# EAGLE design rf (EAGLE 9.1.3)
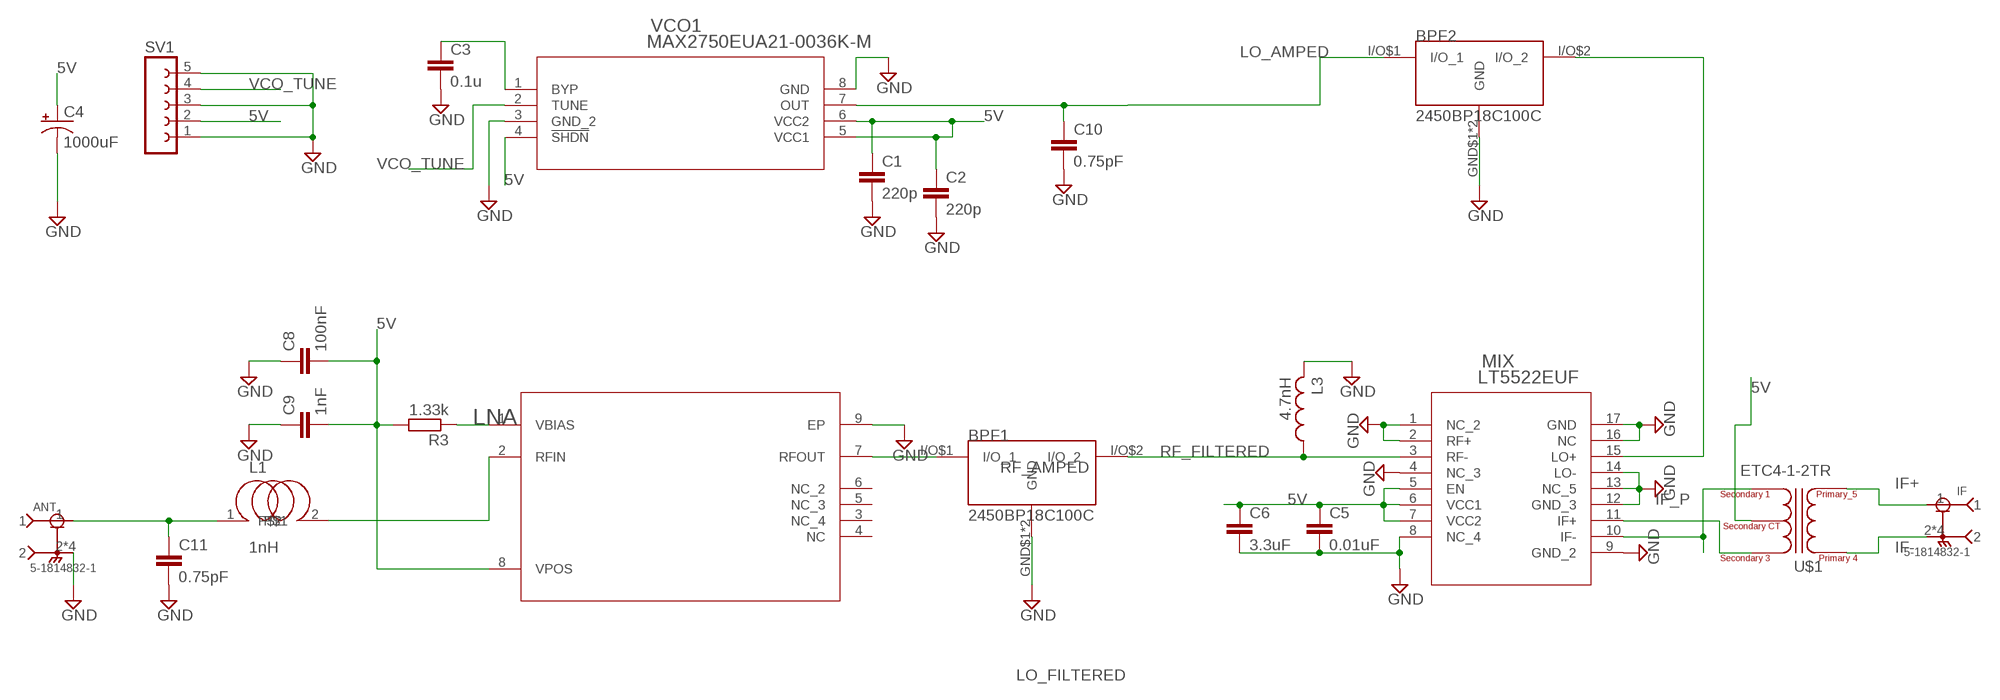
[diagram p0: schematic, sheet 1]

## Parts
ANT  5-1814832-1  [TE_5-1814832-1]
BPF1  2450BP18C100C  [SMD]
BPF2  2450BP18C100C  [SMD]
C1  220p  C-EUC0805K  [C0805K]
C2  220p  C-EUC0805K  [C0805K]
C3  0.1u  C-EUC0805  [C0805]
C4  1000uF  CPOL-US153CLV-1010  [153CLV-1010]
C5  0.01uF  C-EUC0805  [C0805]
C6  3.3uF  C-EUC0805  [C0805]
C8  100nF  C-EUC0805  [C0805]
C9  1nF  C-EUC0805  [C0805]
C10  0.75pF  C-EUC0805  [C0805]
C11  0.75pF  C-EUC0805  [C0805]
IF  5-1814832-1  [TE_5-1814832-1]
L1  1nH  COILCRAFT_INDUCTOR0603/1608M  [INDC1607X61]
L3  4.7nH  L2012M  [INDC2518X180]
LNA  ADL5523ACPZ-R7CP_8_2-M  [CP_8_2-M]
MIX  LT5522EUF  [QFN-16_UF]
R3  1.33k  R-EU_R0805  [R0805]
SV1  FE05-1  [FE05-1]
U$1  ETC4-1-2TR  [SM-22]
VCO1  MAX2750EUA21-0036K-M  [21-0036K-M]

## Nets
5V: C1.1 C2.1 C4.+ C5.1 C6.1 C8.2 C9.2 LNA.8(VPOS) MIX.5(EN) MIX.6(VCC1) MIX.7(VCC2) R3.2 SV1.2 U$1.2(SECONDARY_CT) VCO1.4(!SHDN) VCO1.5(VCC1) VCO1.6(VCC2)
ANTENNA_IN [RF_2G4]: ANT.1 C11.1 L1.1
GND: ANT.2 ANT.3 ANT.4 ANT.5 BPF1.GND$1(GND) BPF1.GND$2(GND) BPF2.GND$1(GND) BPF2.GND$2(GND) C1.2 C2.2 C3.2 C4.- C5.2 C6.2 C8.1 C9.1 C10.2 C11.2 L3.2 LNA.9(EP) MIX.1(NC_2) MIX.2(RF+) MIX.4(NC_3) MIX.8(NC_4) MIX.9(GND_2) MIX.12(GND_3) MIX.13(NC_5) MIX.14(LO-) MIX.16(NC) MIX.17(GND) SV1.1 SV1.3 SV1.5 VCO1.3(GND_2) VCO1.8(GND)
IF+: IF.1 U$1.5(PRIMARY_5)
IF-: IF.2 IF.3 IF.4 IF.5 U$1.4(PRIMARY_4)
IF_P: MIX.11(IF+) U$1.3(SECONDARY_3)
LO_AMPED [RF_2G4]: BPF2.I/O$1(I/O_1) C10.1 VCO1.7(OUT)
LO_FILTERED [RF_2G4]: BPF2.I/O$2(I/O_2) MIX.15(LO+)
N$1: LNA.1(VBIAS) R3.1
N$2: C3.1 VCO1.1(BYP)
N$4: MIX.10(IF-) U$1.1(SECONDARY_1)
N$5 [RF_2G4]: L1.2 LNA.2(RFIN)
RF_AMPED [RF_2G4]: BPF1.I/O$1(I/O_1) LNA.7(RFOUT)
RF_FILTERED [RF_2G4]: BPF1.I/O$2(I/O_2) L3.1 MIX.3(RF-)
VCO_TUNE: SV1.4 VCO1.2(TUNE)
Unconnected: LNA.3(NC_4) LNA.4(NC) LNA.5(NC_3) LNA.6(NC_2)

## Library data of the parts
ANT IF = 5-1814832-1:5-1814832-1: SMA Str PCB Skt GZD; MANUFACTURER: TE Connectivity; PARTREV: B1; STANDARD: Manufacturer recommendations
BPF1 BPF2 = Johanson BPF 2450BP18C100C:2450BP18C100C
C1-C3 C5 C6 C8-C11 = rcl:C-EU: CAPACITOR, European symbol; SPICEPREFIX: C
C4 = rcl:CPOL-US: POLARIZED CAPACITOR, American symbol; SPICEPREFIX: C
L1 = Passives:COILCRAFT_INDUCTOR
L3 = Passives:L2012M
LNA = ADL5523ACPZ-R7:ADL5523ACPZ-R7: LNA for 2.4GHz
MIX = LT5522:LT5522EUF; MANUFACTURER_PART_NUMBER: LT5522EUF; VENDOR: Linear Technology
R3 = rcl:R-EU_: RESISTOR, European symbol; SPICEPREFIX: R
SV1 = con-lsta:FE05-1: FEMALE HEADER; OC_FARNELL: unknown; OC_NEWARK: unknown
U$1 = ETC4-1-2TR:ETC4-1-2TR
VCO1 = MAX2750EUA+:MAX2750EUA; MANUFACTURER_PART_NUMBER: MAX2750EUA+; VENDOR: Maxim

## Net classes
1 RF_2G4: width 0.419 mm, clearance 2 mm

## Board
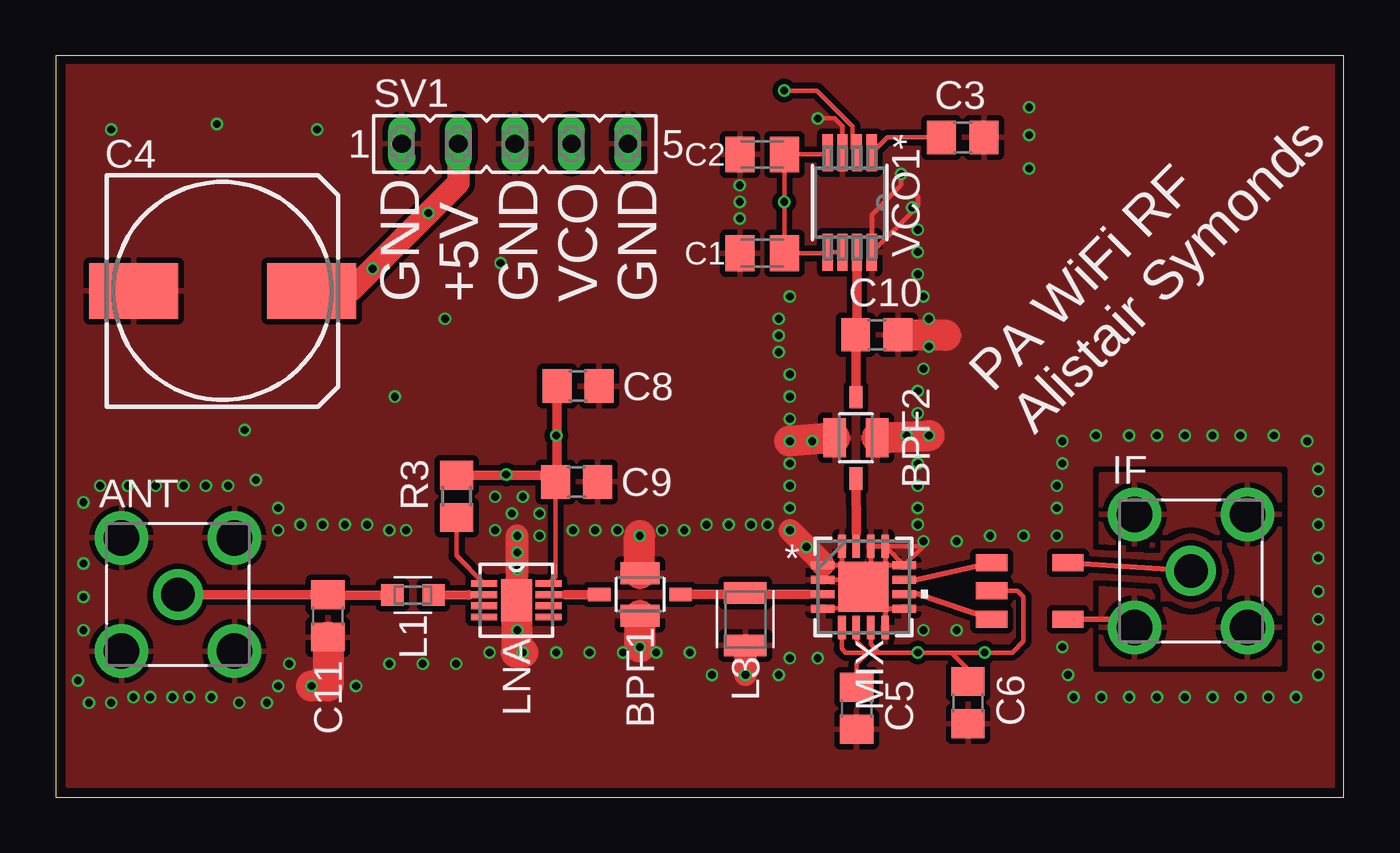
[diagram p1: board, top side]
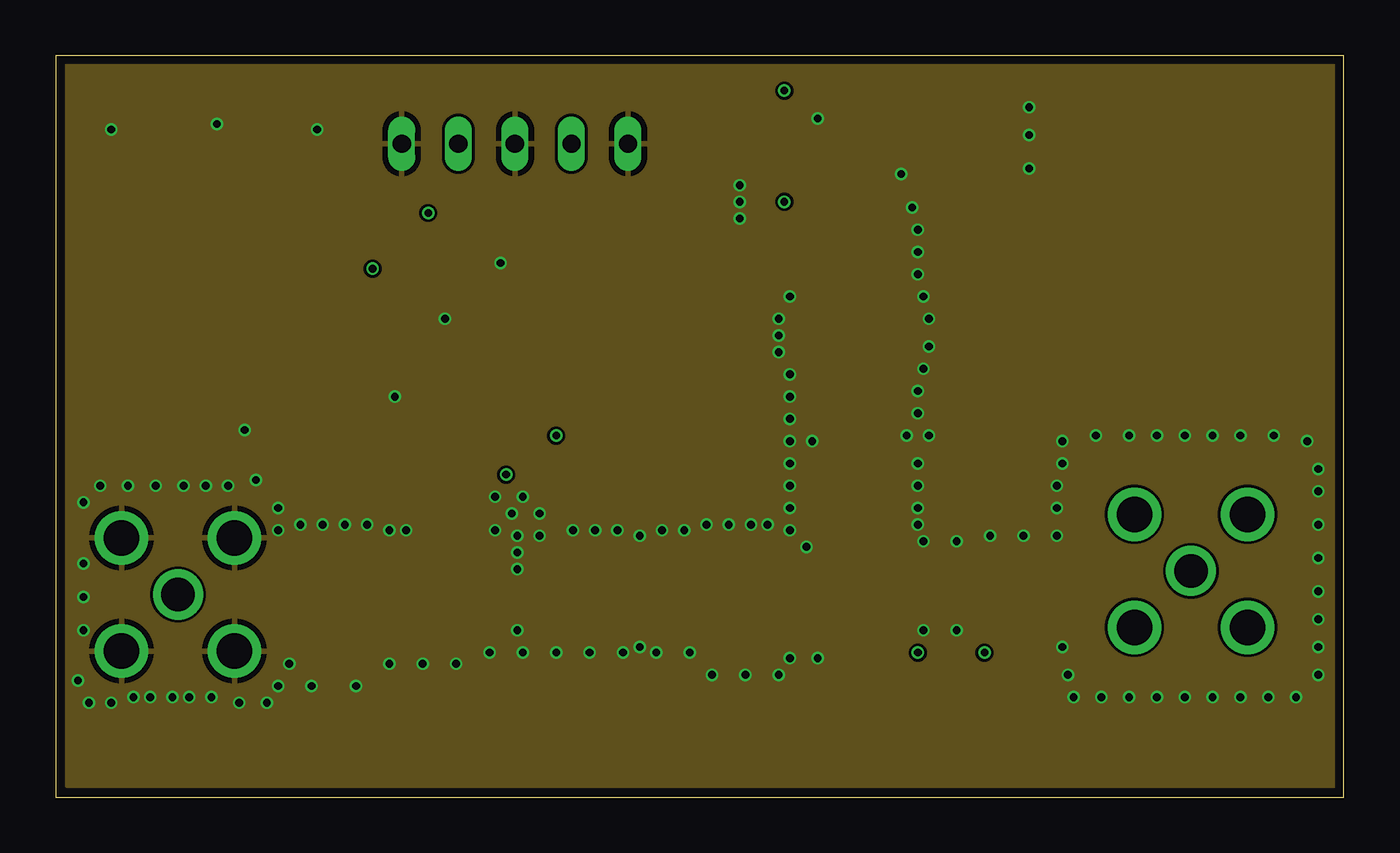
[diagram p2: board, inner layer Route2]
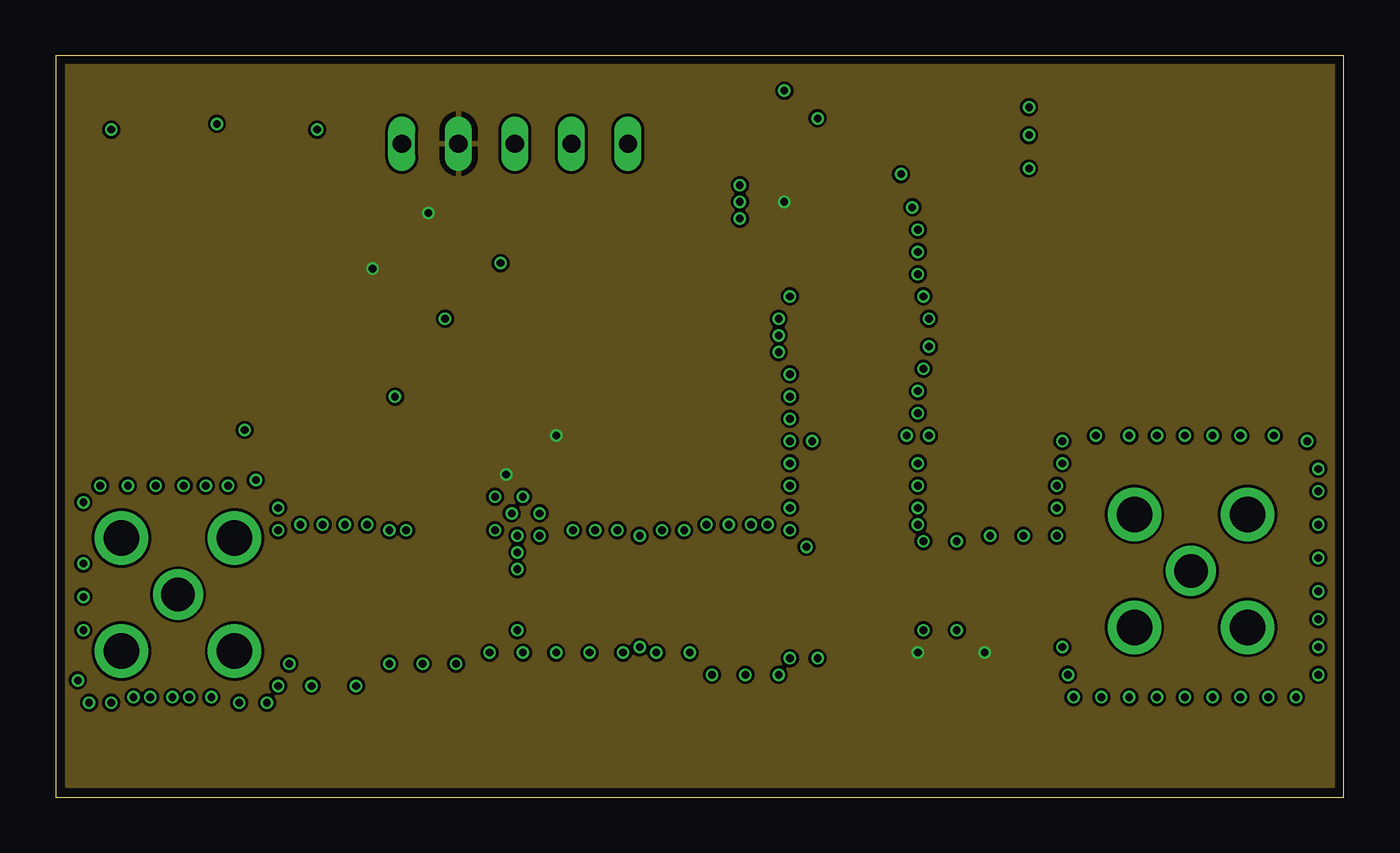
[diagram p3: board, inner layer Route15]
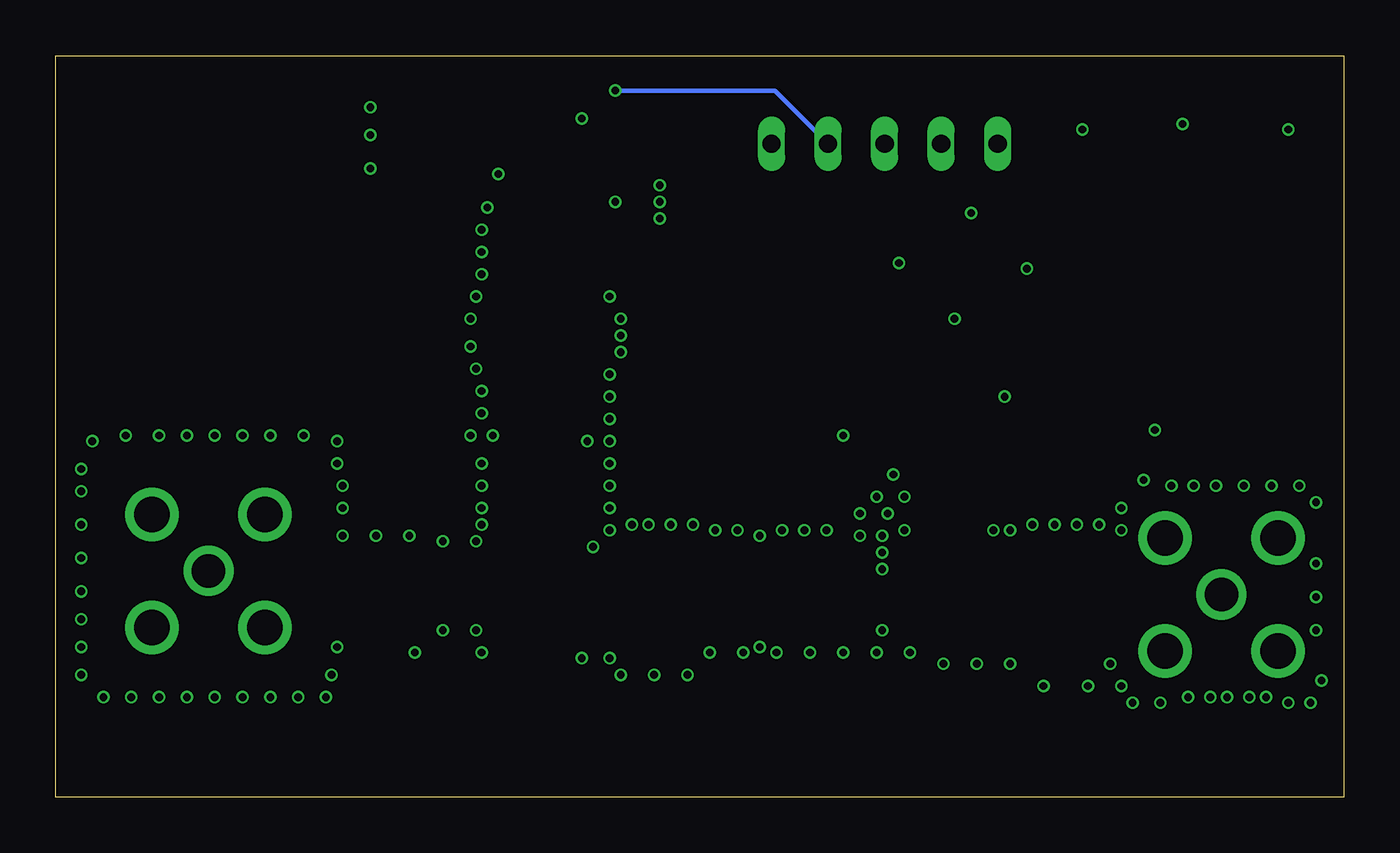
[diagram p4: board, bottom side, seen from below]

Size 57.9 x 33.32 mm. Coordinates in mm from the lower left corner, seen from the top.
Outline: 0,0 57.9,0 57.9,33.32 0,33.32 0,0
Copper layers (1*2*15*16): Top 0.035559375mm / dielectric 0.17018125mm / Route2 0.01778125mm / dielectric 47mil / Route15 0.01778125mm / dielectric 0.17018125mm / Bottom 0.035559375mm
Design rules "oshpark_4layer": minimum track width 5mil, minimum drill 10mil, track to track 5mil, track to pad 5mil, pad to pad 5mil, via to via 5mil, smd to smd 5mil, copper to edge 15mil, drill to drill 6mil, minimum pad ring 4mil, minimum via ring 4mil, stop-mask expansion 2.5mil, vias tented up to drill 0mil, thermal gap 10mil

### Footprints (pad centres in the part's own frame; a part is rotated, then mirrored left to right if it is on the bottom)
TE_5-1814832-1 = drill 1.5: 1 0,0 | drill 1.6: 2 -2.54,2.54; 3 2.54,2.54; 4 -2.54,-2.54; 5 2.54,-2.54
SMD = smd 1.75 x 1: GND$1 1.825,0.95; GND$2 1.825,-0.95 | smd 1 x 0.6: I/O$1 0,0; I/O$2 3.65,0
C0805K = smd 1.3 x 1.6: 1 -1,0; 2 1,0
C0805 = smd 1.3 x 1.5: 1 -0.95,0; 2 0.95,0
153CLV-1010 = smd 4 x 2.5: + 4,0; - -4,0
INDC1607X61 = smd 0.992 x 0.972: 1 -0.925,0; 2 0.925,0
INDC2518X180 = smd 0.962 x 1.912: 1 -1.175,0; 2 1.175,0
CP_8_2-M = smd 1.168 x 0.305: 1 -1.448,0.75; 2 -1.448,0.25; 3 -1.448,-0.25; 4 -1.448,-0.75; 5 1.448,-0.75; 6 1.448,-0.25; 7 1.448,0.25; 8 1.448,0.75 | smd 1.397 x 1.88: 9 0,0
QFN-16_UF = smd 1.055 x 0.35: 1 -1.827,0.975; 2 -1.827,0.325; 3 -1.827,-0.325; 4 -1.827,-0.975; 9 1.827,-0.975; 10 1.827,-0.325; 11 1.827,0.325; 12 1.827,0.975 | smd 0.35 x 1.055: 5 -0.975,-1.827; 6 -0.325,-1.827; 7 0.325,-1.827; 8 0.975,-1.827; 13 0.975,1.827; 14 0.325,1.827; 15 -0.325,1.827; 16 -0.975,1.827 | smd 2.25 x 2.25: 17 0,0
R0805 = smd 1.3 x 1.5: 1 -0.95,0; 2 0.95,0
FE05-1 = drill 0.813 long: 1 -5.08,0; 2 -2.54,0; 3 0,0; 4 2.54,0; 5 5.08,0
SM-22 = smd 0.76 x 1.4: 1 0,3.43; 2 1.27,3.43; 3 2.54,3.43; 4 0,0; 5 2.54,0
21-0036K-M = smd 1.676 x 0.457: 1 -2.235,0.991; 2 -2.235,0.33; 3 -2.235,-0.33; 4 -2.235,-0.991; 5 2.235,-0.991; 6 2.235,-0.33; 7 2.235,0.33; 8 2.235,0.991

### Placement (x,y rotation side)
ANT  5.5,9.11 0 top
BPF1  24.44,9.11 0 top
BPF2  35.97,17.97 270 top
C1  31.76,24.44 180 top
C2  31.76,28.88 180 top
C3  40.77,29.65 0 top
C4  7.5,22.75 0 top
C5  36,4 270 top
C6  41,4.25 270 top
C8  23.48,18.47 180 top
C9  23.41,14.17 180 top
C10  36.91,20.78 0 top
C11  12.24,8.15 270 top
IF  51.03,10.17 0 top
L1  16.06,9.08 0 top
L3  31,8 270 top
LNA  20.71,8.85 0 top
MIX  36.31,9.45 0 top
R3  18.02,13.52 90 top
SV1  20.64,29.36 0 top
U$1  45.5,8 90 top
VCO1  35.69,26.72 270 top

### Tracks (layer width: path | path; a pad name or v marks a point on that pad's centre or on a via)
5V  (via drill 0.35)
  Top 0.2: LNA.8 22.46,9.9 C9.2 22.5,14.21 v22.5,16.25 | U$1.2 43.23,9.27 43.5,9 43.5,7 43,6.5 v41.75,6.5 40.25,6.5 | 36.5,6.5 36.02,6.98 36.02,7.59 MIX.6 | 40.25,6.5 v38.75,6.5 37,6.5 | 37,6.5 36.5,6.5 | MIX.5 35.34,6.66 35.5,6.5 36.5,6.5 | MIX.7 36.63,6.87 37,6.5 | VCO1.4 34.62,28.88 C2.1 v32.76,26.76 v32.75,26.75 v32.76,26.74 C1.1 34.66,24.44 VCO1.5 VCO1.6 | C5.1 36,6 36.5,6.5 | C6.1 41,5.75 40.25,6.5
  Top 0.419: R3.2 22.16,14.47 C9.2 22.53,14.24 C8.2
  Top 1: C4.+ 13.25,22.75 v14.25,23.75 v16.75,26.25 18.1,27.6 SV1.2
  other vias: 20.25,14.5
  pour Route15 (rank 6): 0.5,33 0.5,0.5 57.5,0.5 57.5,33
ANTENNA_IN
  Top 0.419: L1.1 12.26,9.08 C11.1 ANT.1
GND  (via drill 0.35)
  Top 0.2: VCO1.3 35.36,30.14 35,30.5 v34.25,30.5 | 38,27.75 38,27.5 36.68,26.18 VCO1.8 38.75,26.55 38.75,27 | MIX.13 MIX.12 | MIX.13 MIX.14 36.63,9.77 MIX.17 | MIX.4 34.51,8.5 35.5,8.5 36.31,9.31 | 36.31,9.31 MIX.17 | 35.34,10.43 MIX.1 MIX.2 35.98,9.77 MIX.17 | 35.34,10.43 MIX.17 | MIX.12 37.42,10.43 36.38,9.38 | 36.38,9.38 36.31,9.31 | MIX.8 37.28,8.46 36.5,9.25 | 36.5,9.25 36.38,9.38 | MIX.9 37.27,8.47 36.5,9.25 | MIX.16 35.34,10.43 | 35.34,10.43 MIX.17 | MIX.13 38.78,11.28 v39,11.5 39,11.29 MIX.12 | MIX.13 37.28,10.43 MIX.17 | 15.56,29.11 SV1.1
  Top 1: LNA.9 20.73,10.84 v20.75,11.75 | MIX.1 34.48,10.52 v33.75,11.25 v33,12 | L3.2 v31,5.5
  Top 1.4: C10.2 39.97,20.78 40,20.75 | v39.25,16.25 36.93,16.16 BPF2.GND$1 | BPF2.GND$2 v33,16 | LNA.9 20.71,6.5 v21,6.5 | BPF1.GND$1 26.25,10.06 v26.25,11.75 | BPF1.GND$2 26.25,8.16 v26.25,6.75 | C11.2 12.24,5 v11.5,5
  other vias: 10.5,6 13.5,5 15,6 16.5,6 18,6 19.5,6.5 22.5,6.5 24,6.5 25.5,6.5 27,6.5 28.5,6.5 29.5,5.5 32.5,5.5 39,7.5 40.5,7.5 40.5,11.5 31.25,12.25 32,12.25 33,13 33,14 33,15 33,17 33,18 33,19 32.5,20 32.5,21.5 33,22.5 30.75,27.5 30.75,26.75 30.75,26 34,16 38.25,16.25 38,28 38.5,26.5 38.75,25.5 38.75,24.5 38.75,23.5 39,22.5 39.25,21.5 39.25,20.25 39,19.25 38.75,18.25 38.75,17.25 38.75,15 38.75,14 38.75,13 38.75,12.25 28.25,12 29.25,12.25 30.25,12.25 27.25,12 25.25,12 24.25,12 23.25,12 21.75,11.75 19.75,12 20.5,12.75 21,13.5 21.75,12.75 10,12 11,12.25 12,12.25 13,12.25 14,12.25 15,12 15.75,12 33,6.25 34.25,6.25 19.75,13.5 45,11.75 45,13 42,11.75 43.5,11.75 45,14 45.25,15 45.25,16 46.75,16.25 48.25,16.25 49.5,16.25 50.75,16.25 52,16.25 53.25,16.25 54.75,16.25 56.25,16 56.75,14.75 56.75,13.75 56.75,12.25 56.75,10.75 56.75,9.25 56.75,8 56.75,6.75 56.75,5.5 55.75,4.5 54.5,4.5 53.25,4.5 52,4.5 50.75,4.5 49.5,4.5 48.25,4.5 47,4.5 45.75,4.5 45.5,5.5 45.25,6.75 1.25,13.25 2,14 3.25,14 4.5,14 5.75,14 6.75,14 7.75,14 9,14.25 10,13 10,5 9.5,4.25 8.25,4.25 7,4.5 6,4.5 3.5,4.5 2.5,4.25 1.5,4.25 1,5.25 1.25,7.5 1.25,9 1.25,10.5 4.25,4.5 5.25,4.5 2.5,30 7.25,30.25 11.75,30 20,24 8.5,16.5 15.25,18 17.5,21.5 32.5,20.75 43.75,28.25 43.75,29.75 43.75,31 20.75,11 20.75,10.25 20.75,7.5
  pour Route2: 0.5,33 0.5,0.5 57.5,0.5 57.5,33
  pour Top (isolate 0.254, rank 6): 0.5,33 0.5,0.5 57.5,0.5 57.5,33
IF+
  Top 0.254: U$1.5 IF.1
IF-
  Top 0.254: U$1.4 48.12,8 IF.4
  pour Top (isolate 0.813): 47,14.5 47,6 55,6 55,14.5
IF_P
  Top 0.254: MIX.11 38.68,9.78 U$1.3
LO_AMPED
  Top 0.419: 35.99,17.99 BPF2.I/O$1 C10.1 | 36.04,24.46 VCO1.7 36.02,20.78 C10.1 | C10.1
LO_FILTERED
  Top 0.203: MIX.15 35.98,11.89
  Top 0.419: 35.98,11.89 BPF2.I/O$2 | BPF2.I/O$2 | BPF2.I/O$2
N$1
  Top 0.2: R3.1 18.02,10.84 | 18.02,10.84 LNA.1 | 18.02,10.84
N$2
  Top 0.2: VCO1.1 37.38,29.65 C3.1
N$4
  Top 0.254: MIX.10 38.7,9.14 U$1.1
N$5
  Top 0.2: LNA.2 18.57,9.1
  Top 0.419: 18.57,9.1 18.55,9.08 17,9.1 L1.2
RF_AMPED
  Top 0.2: 22.89,9.09 LNA.7
  Top 0.419: 22.89,9.09 24.42,9.09 BPF1.I/O$1
RF_FILTERED
  Top 0.203: MIX.3 33.85,9.12
  Top 0.419: 33.85,9.12 33.85,9.11 32.5,9.12 | 32.5,9.12 28.09,9.13 BPF1.I/O$2 | 32.5,9.12 31.06,9.12 L3.1
VCO_TUNE  (via drill 0.35)
  Top 0.2: VCO1.2 35.81,29.16 35.81,30.15 34.21,31.75 v32.75,31.75
  Bottom 0.2: SV1.4 25.57,31.75 v32.75,31.75

### Text on the board
tNames: GND / +5V / GND / VCO / GND | PA WiFi RF / Alistair Symonds